# EasyEDA schematic OP2_1.json
TITLE: Sheet_2; REV: 1.0; Date: 2022-10-13; Sheet: 1/1; Company: Your Company
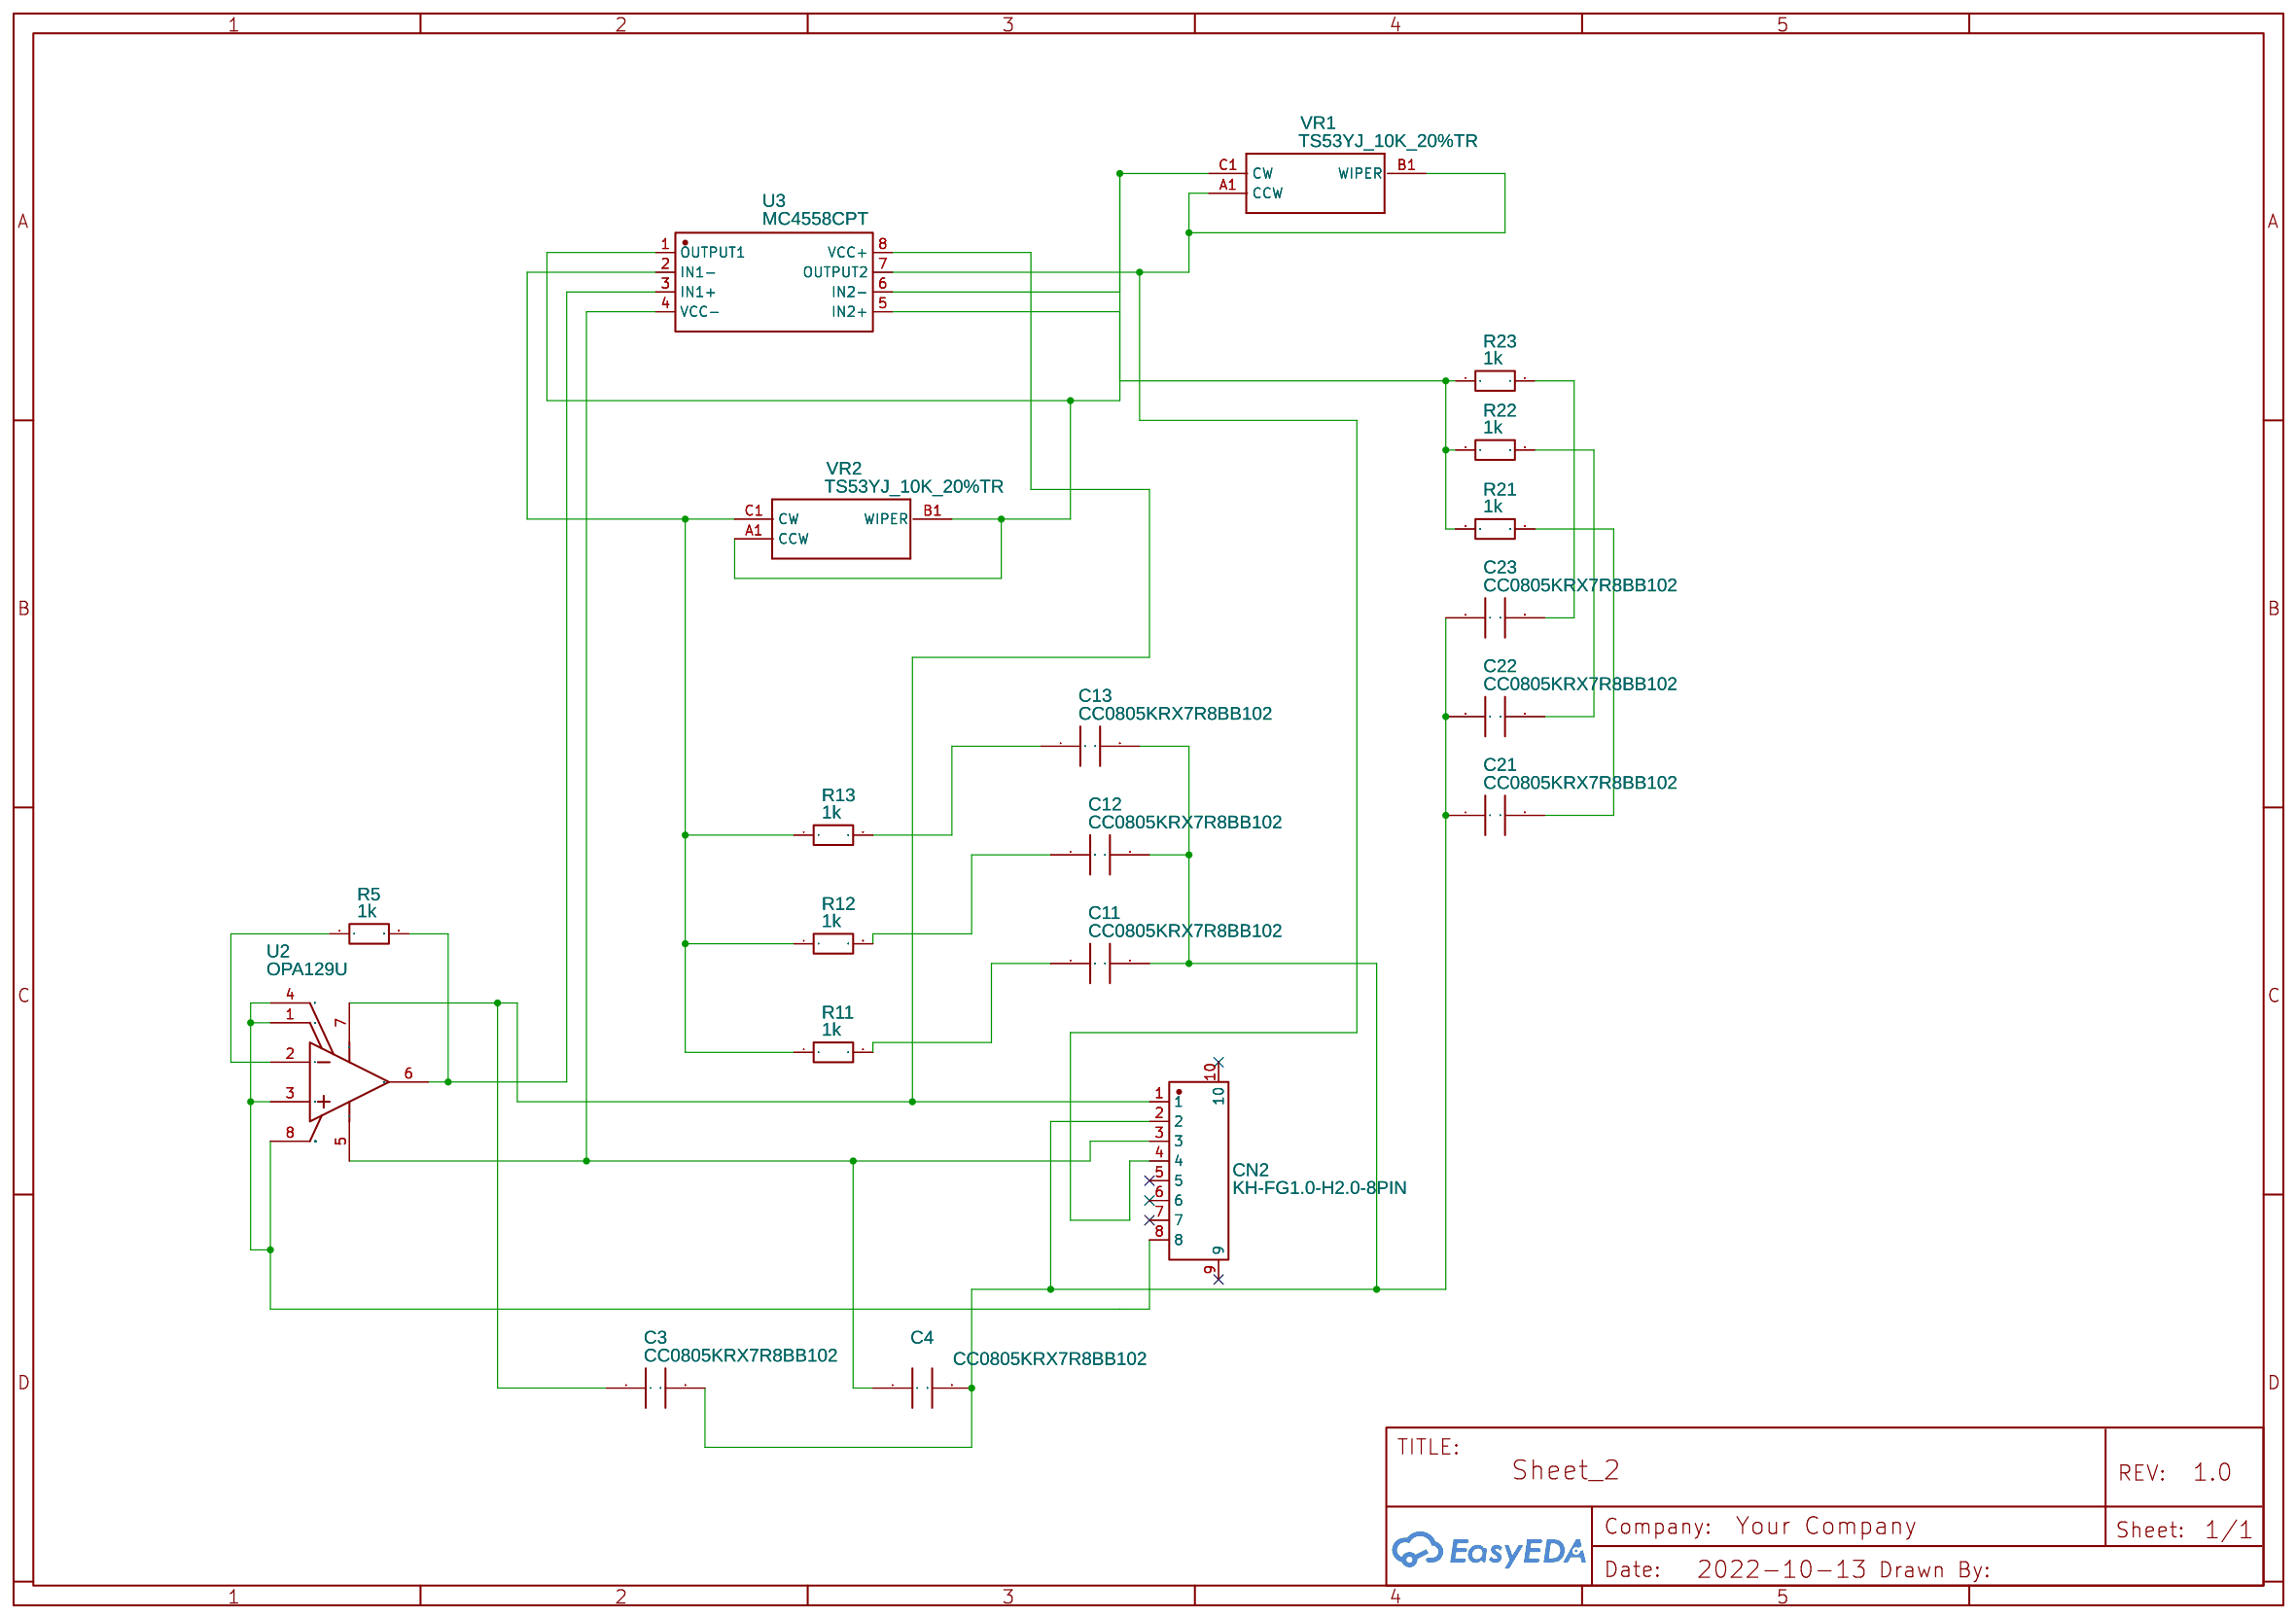
[diagram p0: schematic sheet]

## Parts
C3  CC0805KRX7R8BB102  [CC0805KRX7R8BB102]
C4  CC0805KRX7R8BB102  [CC0805KRX7R8BB102]
C11  CC0805KRX7R8BB102  [CC0805KRX7R8BB102]
C12  CC0805KRX7R8BB102  [CC0805KRX7R8BB102]
C13  CC0805KRX7R8BB102  [CC0805KRX7R8BB102]
C21  CC0805KRX7R8BB102  [CC0805KRX7R8BB102]
C22  CC0805KRX7R8BB102  [CC0805KRX7R8BB102]
C23  CC0805KRX7R8BB102  [CC0805KRX7R8BB102]
CN2  KH-FG1.0-H2.0-8PIN  [FPC-SMD_KH-FG1.0-H2.0-8PIN]
R5  1k  [R0603]
R11  1k  [R0603]
R12  1k  [R0603]
R13  1k  [R0603]
R21  1k  [R0603]
R22  1k  [R0603]
R23  1k  [R0603]
U2  OPA129U  [SOIC-8_L4.9-W3.9-P1.27-LS6.0-BL]
U3  MC4558CPT  [TSSOP-8_L4.4-W3.0-P0.65-LS6.4-BL-2]
VR1  TS53YJ_10K_20%TR  [TS53YJ10K20TR]
VR2  TS53YJ_10K_20%TR  [TS53YJ10K20TR]

## Library data of the parts
C3 C4 C11-C13 C21-C23 = CC0805KRX7R8BB102: Manufacturer: Yageo; Supplier: Digi-Key; Supplier Part: 311-4314-1-ND; link: https://www.digikey.com.au/product-detail/en/yageo/CC0805JRX7R8BB104/311-3562-1-ND/7648489; Contributor: CamMoody
CN2 = KH-FG1.0-H2.0-8PIN: Supplier: LCSC; Supplier Part: C2797225; Manufacturer: kinghelm(金航标); Contributor: LCSC; JLCPCB Part Class: Extended Part
R5 R11-R13 R21-R23 = R_0603_EU: Contributor: LCEDA_Lib
U2 = OPA129U: Supplier: LCSC; Supplier Part: C56181; Manufacturer: Texas Instruments; Contributor: LCSC; JLCPCB Part Class: Extended Part
U3 = MC4558CPT: Supplier: LCSC; Supplier Part: C283326; Manufacturer: STMicroelectronics; Contributor: LCSC; JLCPCB Part Class: Extended Part
VR1 VR2 = TS53YJ_10K_20%TR: Contributor: Snoopfill

## Nets
Net-(C3-1): C3.1 CN2.1 U2.7(V+) U3.8(VCC+)
Net-(C3-2): C3.2 C4.2 C11.2 C12.2 C13.2 C21.1 C22.1 C23.1 CN2.2
Net-(C4-1): C4.1 CN2.3 U2.5(V-) U3.4(VCC-)
Net-(C11-1): C11.1 R11.2
Net-(C12-1): C12.1 R12.2
Net-(C13-1): C13.1 R13.2
Net-(C21-2): C21.2 R21.2
Net-(C22-2): C22.2 R22.2
Net-(C23-2): C23.2 R23.2
Net-(CN2-4): CN2.4 U3.7(OUTPUT2) VR1.A1(CCW) VR1.B1(WIPER)
Net-(CN2-8): CN2.8 U2.1(NC) U2.3(IN+) U2.4(NC) U2.8(SUBSTRATE)
Net-(R5-1): R5.1 U2.2(IN-)
Net-(R5-2): R5.2 U2.6(OUT) U3.3(IN1+)
Net-(R11-1): R11.1 R12.1 R13.1 U3.2(IN1-) VR2.C1(CW)
Net-(R21-1): R21.1 R22.1 R23.1 U3.6(IN2-) VR1.C1(CW)
Net-(U3-1): U3.1(OUTPUT1) U3.5(IN2+) VR2.A1(CCW) VR2.B1(WIPER)

Not connected (* = marked no-connect by the designer): CN2 5* 6* 7* 9* 10*
